# Altium schematic sheet 蓝桥杯2.0.SchDoc
size 508 x 317 mm; PageSetup: Record=PageOptions|CenterHorizontal=True|CenterVertical=True|PrintScale=0.56|XCorrection=1.00|YCorrection=1.00|PrintKind=0|BorderSize=5000000|LeftOffset=0|BottomOffset=0|Orientation=2|PaperLength=1000|PaperWidth=1000|Scale=100|PaperSource=7|PrintQuality=-4|MediaType=1|DitherType=10|PrintScaleMode=1|PaperKind=A4|PaperIndex=9
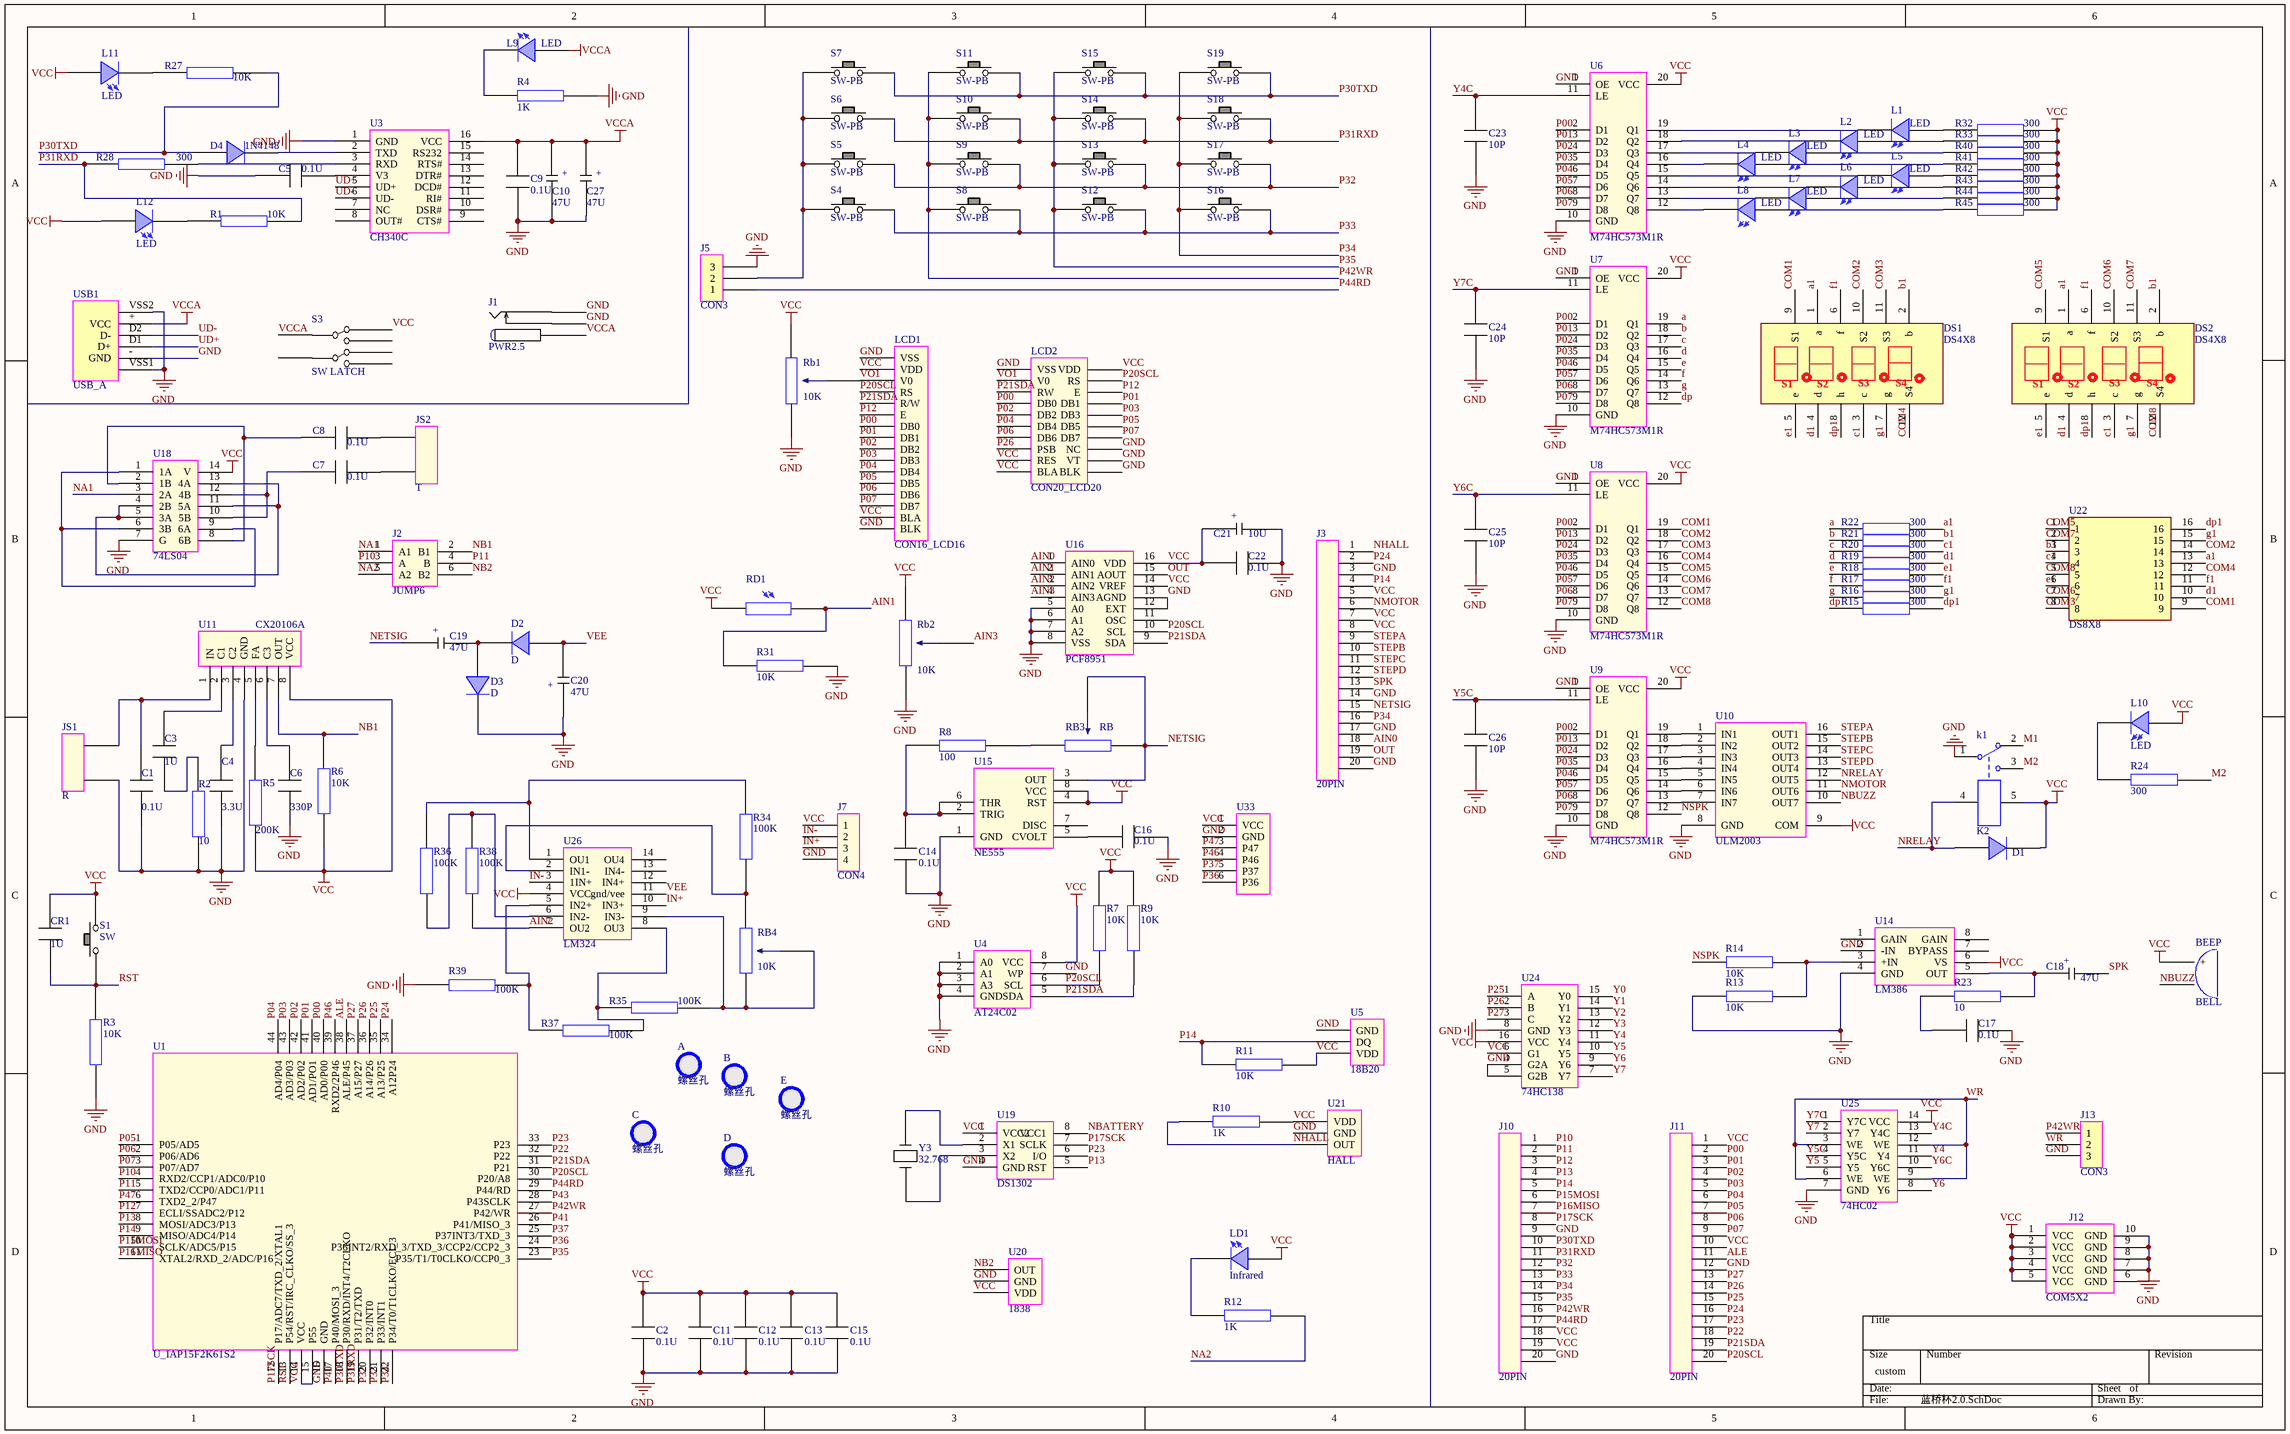
[diagram p0: 蓝桥杯2.0.SchDoc]

## Parts
A  螺丝孔  [LUOSIKONG]
B  螺丝孔  [LUOSIKONG]
BEEP  BELL  [BUZZER]
C  螺丝孔  [LUOSIKONG]
C1  0.1U  [C0805]
C2  0.1U  [C0805]
C3  1U  [C0805]
C4  3.3U  [C0805]
C5  0.1U  [C0805]
C6  330P  [C0805]
C7  0.1U  [C0805]
C8  0.1U  [C0805]
C9  0.1U  [C0805]
C10  47U  [RVT 16V]
C11  0.1U  [C0805]
C12  0.1U  [C0805]
C13  0.1U  [C0805]
C14  0.1U  [C0805]
C15  0.1U  [C0805]
C16  0.1U  [C0805]
C17  0.1U  [C0805]
C18  47U  [RVT 16V]
C19  47U  [RVT 16V]
C20  47U  [RVT 16V]
C21  10U  [RVT 16V]
C22  0.1U  [C0805]
C23  10P  [C0805]
C24  10P  [C0805]
C25  10P  [C0805]
C26  10P  [C0805]
C27  47U  [RVT 16V]
CR1  1U  [C0805]
D  螺丝孔  [LUOSIKONG]
D1  D  [D-DIODE-0805]  (value not drawn)
D2  D  [D-DIODE-0805]
D3  D  [D-DIODE-0805]
D4  1N4148  [D-DIODE-0805]
DS1  DS4X8  [DPY-4X8]
DS2  DS4X8  [DPY-4X8]
E  螺丝孔  [LUOSIKONG]
J1  PWR2.5  [PW 2.5]
J2  JUMP6  [SIP-3X2]
J3  20PIN  [SIP-20 - duplicate]
J5  CON3  [SIP-3]
J7  CON4  [SIP-4]
J10  20PIN  [SIP-20 - duplicate]
J11  20PIN  [SIP-20 - duplicate]
J12  COM5X2  [SIP-5X2]
J13  CON3  [SIP-3]
JS1  R  [RT-16]
JS2  T  [RT-16]
k1  K2  [HK-4100-F]
L1  LED  [L0805]
L2  LED  [L0805]
L3  LED  [L0805]
L4  LED  [L0805]
L5  LED  [L0805]
L6  LED  [L0805]
L7  LED  [L0805]
L8  LED  [L0805]
L9  LED  [L0805]
L10  LED  [L0805]
L11  LED  [L0805]
L12  LED  [L0805]
LCD1  CON16_LCD16  [SIP-16]
LCD2  CON20_LCD20  [SIP-20]
LD1  Infrared  [LED-LNF]
R1  10K  [R0805]
R2  10  [R0805]
R3  10K  [R0805]
R4  1K  [R0805]
R5  200K  [R0805]
R6  10K  [R0805]
R7  10K  [R0805]
R8  100  [R0805]
R9  10K  [R0805]
R10  1K  [R0805]
R11  10K  [R0805]
R12  1K  [R0805]
R13  10K  [R0805]
R14  10K  [R0805]
R15  300  [R0805]
R16  300  [R0805]
R17  300  [R0805]
R18  300  [R0805]
R19  300  [R0805]
R20  300  [R0805]
R21  300  [R0805]
R22  300  [R0805]
R23  10  [R0805]
R24  300  [R0805]
R27  10K  [R0805]
R28  300  [R0805]
R31  10K  [R0805]
R32  300  [R0805]
R33  300  [R0805]
R34  100K  [R0805]
R35  100K  [R0805]
R36  100K  [R0805]
R37  100K  [R0805]
R38  100K  [R0805]
R39  100K  [R0805]
R40  300  [R0805]
R41  300  [R0805]
R42  300  [R0805]
R43  300  [R0805]
R44  300  [R0805]
R45  300  [R0805]
Rb1  10K  [VR-3 10]
Rb2  10K  [VR-3 10]
RB3  RB  [VR-3 10]
RB4  10K  [VR-3 10]
RD1  RD  [AXIAL-0.2]  (value not drawn)
S1  SW  [SKOE]
S3  SW LATCH  [SW-PB]
S4  SW-PB  [SKOE]
S5  SW-PB  [SKOE]
S6  SW-PB  [SKOE]
S7  SW-PB  [SKOE]
S8  SW-PB  [SKOE]
S9  SW-PB  [SKOE]
S10  SW-PB  [SKOE]
S11  SW-PB  [SKOE]
S12  SW-PB  [SKOE]
S13  SW-PB  [SKOE]
S14  SW-PB  [SKOE]
S15  SW-PB  [SKOE]
S16  SW-PB  [SKOE]
S17  SW-PB  [SKOE]
S18  SW-PB  [SKOE]
S19  SW-PB  [SKOE]
U1  U_IAP15F2K61S2  [LQFP44 - duplicate]
U3  CH340C  [SOP-16]
U4  AT24C02  [SOP-8]
U5  18B20  [TO-92]
U6  M74HC573M1R  [TSOP-20(宽体)]
U7  M74HC573M1R  [TSOP-20(宽体)]
U8  M74HC573M1R  [TSOP-20(宽体)]
U9  M74HC573M1R  [TSOP-20(宽体)]
U10  ULM2003  [SOP-16]
U11  CX20106A  [DIP-8]
U14  LM386  [SOP-8]
U15  NE555  [SOP-8]
U16  PCF8951  [TSOP-16(宽体)]
U18  74LS04  [SOP-14]
U19  DS1302  [SOP-8]
U20  1838  [TO-92-A]
U21  HALL  [TO92-3]
U22  DS8X8  [DPY-8X8]
U24  74HC138  [SOP-16]
U25  74HC02  [SOP-14]
U26  LM324  [SOP-14]
U33  (no value)  [D0]
USB1  USB_A  [USB-B]
Y3  32.768  [XTAL1-37K]

## Nets
GND: C1.1 C2.1 C4.1 C5.1 C6.1 C9.1 C10.2(-) C11.1 C12.1 C13.1 C14.1 C15.1 C16.2 C17.2 C20.1(+) C21.2(-) C22.2 C23.1 C24.1 C25.1 C26.1 C27.2(-) D3.2 J1.GND J3.3 J3.14 J3.17 J3.20 J5.3 J7.4 J10.9 J10.20 J11.12 J12.6(GND) J12.7(GND) J12.8(GND) J12.9(GND) J12.10(GND) J13.3 JS1.2 k1.1 LCD1.1(VSS) LCD1.16(BLK) LCD2.1(VSS) LCD2.16(NC) LCD2.18(VT) LCD2.20(BLK) R2.1 R3.1 R4.1 R13.2 R31.1 R39.2 Rb1.1 Rb2.3 U1.16(GND) U3.1(GND) U4.1(A0) U4.2(A1) U4.3(A3) U4.4(GND) U4.7(WP) U5.1(GND) U6.1(OE) U6.10(GND) U7.1(OE) U7.10(GND) U8.1(OE) U8.10(GND) U9.1(OE) U9.10(GND) U10.8(GND) U11.4(GND) U14.2(-IN) U14.4(GND) U15.1(GND) U16.5(A0) U16.6(A1) U16.7(A2) U16.8(VSS) U16.12(EXT) U16.13(AGND) U18.7(G) U19.4(GND) U20.2(GND) U21.2(GND) U24.4(G2A) U24.5(G2B) U24.8(GND) U25.7(GND) U33.2(GND) USB1.-(GND) USB1.VSS1 USB1.VSS2
VCC: BEEP.1(+) C2.2 C11.2 C12.2 C13.2 C15.2 C21.1(+) C22.1 CR1.2 D1.2 J3.5 J3.7 J3.8 J7.1 J10.18 J10.19 J11.1 J11.10 J12.1(VCC) J12.2(VCC) J12.3(VCC) J12.4(VCC) J12.5(VCC) k1.5 L10.1 L11.1 L12.1 LCD1.2(VDD) LCD1.15(BLA) LCD2.2(VDD) LCD2.17(RES) LCD2.19(BLA) LD1.1 R5.1 R6.1 R7.2 R9.2 R10.1 R11.1 R32.1 R33.1 R40.1 R41.1 R42.1 R43.1 R44.1 R45.1 Rb1.3 Rb2.1 RD1.1 S1.1 S3.2 U1.14(VCC) U1.15(P55) U4.8(VCC) U5.3(VDD) U6.20(VCC) U7.20(VCC) U8.20(VCC) U9.20(VCC) U10.9(COM) U11.8(VCC) U14.6(VS) U15.4(RST) U15.8(VCC) U16.14(VREF) U16.16(VDD) U18.14(V) U19.1(VCC2) U20.3(VDD) U21.1(VDD) U24.6(G1) U24.16(VCC) U25.14(VCC) U26.4(VCC) U33.1(VCC)
VCCA: C9.2 C10.1(+) C27.1(+) J1.VCCA L9.1 S3.3 U3.16(VCC) USB1.+(VCC)
a: R22.2 U7.19(Q1)
a1: DS1.1(a) DS2.1(a) R22.1 U22.13
AIN0: J3.18 U16.1(AIN0)
AIN1: R31.2 RD1.2 U16.2(AIN1)
AIN2: R38.2 U16.3(AIN2) U26.7(OU2)
AIN3: Rb2.2 U16.4(AIN3)
ALE: J11.11 U1.38(ALE/P45)
b: R21.2 U7.18(Q2)
b1: DS1.2(b) DS2.2(b) R21.1 U22.3
c: R20.2 U7.17(Q3)
c1: DS1.3(c) DS2.3(c) R20.1 U22.4
COM1: DS1.9(S1) U8.19(Q1) U22.9
COM2: DS1.10(S2) U8.18(Q2) U22.14
COM3: DS1.11(S3) U8.17(Q3) U22.8
COM4: DS1.12(S4) U8.16(Q4) U22.12
COM5: DS2.9(S1) U8.15(Q5) U22.1
COM6: DS2.10(S2) U8.14(Q6) U22.7
COM7: DS2.11(S3) U8.13(Q7) U22.2
COM8: DS2.12(S4) U8.12(Q8) U22.5
d: R19.2 U7.16(Q4)
d1: DS1.4(d) DS2.4(d) R19.1 U22.10
dp: R15.2 U7.12(Q8)
dp1: DS1.8(h) DS2.8(h) R15.1 U22.16
e: R18.2 U7.15(Q5)
e1: DS1.5(e) DS2.5(e) R18.1 U22.6
f: R17.2 U7.14(Q6)
f1: DS1.6(f) DS2.6(f) R17.1 U22.11
g: R16.2 U7.13(Q7)
g1: DS1.7(g) DS2.7(g) R16.1 U22.15
IN+: J7.3 U26.10(IN3+)
IN-: J7.2 U26.3(1IN+)
M1: k1.2
M2: k1.3 R24.1
NA1: J2.1(A1) U18.3(2A)
NA2: J2.5(A2) R12.1
NB1: J2.2(B1) R6.2 U11.7(OUT)
NB2: J2.6(B2) U20.1(OUT)
NBATTERY: U19.8(VCC1)
NBUZZ: BEEP.2 U10.10(OUT7)
NETSIG: C19.1(+) J3.15 RB3.2 RB3.3 U15.3(OUT)
NHALL: J3.1 R10.2 U21.3(OUT)
NMOTOR: J3.6 U10.11(OUT6)
NRELAY: D1.1 k1.4 U10.12(OUT5)
NSPK: R14.2 U9.12(Q8)
OUT: J3.19 U16.15(AOUT)
P00: J11.2 LCD1.7(DB0) LCD2.7(DB0) U1.40(AD0/P00) U6.2(D1) U7.2(D1) U8.2(D1) U9.2(D1)
P01: J11.3 LCD1.8(DB1) LCD2.8(DB1) U1.41(AD1/PO1) U6.3(D2) U7.3(D2) U8.3(D2) U9.3(D2)
P02: J11.4 LCD1.9(DB2) LCD2.9(DB2) U1.42(AD2/P02) U6.4(D3) U7.4(D3) U8.4(D3) U9.4(D3)
P03: J11.5 LCD1.10(DB3) LCD2.10(DB3) U1.43(AD3/P03) U6.5(D4) U7.5(D4) U8.5(D4) U9.5(D4)
P04: J11.6 LCD1.11(DB4) LCD2.11(DB4) U1.44(AD4/P04) U6.6(D5) U7.6(D5) U8.6(D5) U9.6(D5)
P05: J11.7 LCD1.12(DB5) LCD2.12(DB5) U1.1(P05/AD5) U6.7(D6) U7.7(D6) U8.7(D6) U9.7(D6)
P06: J11.8 LCD1.13(DB6) LCD2.13(DB6) U1.2(P06/AD6) U6.8(D7) U7.8(D7) U8.8(D7) U9.8(D7)
P07: J11.9 LCD1.14(DB7) LCD2.14(DB7) U1.3(P07/AD7) U6.9(D8) U7.9(D8) U8.9(D8) U9.9(D8)
P10: J2.3(A) J10.1 U1.4(RXD2/CCP1/ADC0/P10)
P11: J2.4(B) J10.2 U1.5(TXD2/CCP0/ADC1/P11)
P12: J10.3 LCD1.6(E) LCD2.6(E) U1.7(ECLI/SSADC2/P12)
P13: J10.4 U1.8(MOSI/ADC3/P13) U19.5(RST)
P14: J3.4 J10.5 R11.2 U1.9(MISO/ADC4/P14) U5.2(DQ)
P15MOSI: J10.6 U1.10(SCLK/ADC5/P15)
P16MISO: J10.7 U1.11(XTAL2/RXD_2/ADC/P16)
P17SCK: J10.8 U1.12(P17/ADC7/TXD_2/XTAL1) U19.7(SCLK)
P20SCL: J11.20 LCD1.4(RS) LCD2.4(RS) R7.1 U1.30(P20/A8) U4.6(SCL) U16.10(SCL)
P21SDA: J11.19 LCD1.5(R/W) LCD2.5(RW) R9.1 U1.31(P21) U4.5(SDA) U16.9(SDA)
P22: J11.18 U1.32(P22)
P23: J11.17 U1.33(P23) U19.6(I/O)
P24: J3.2 J11.16 U1.34(A12P24)
P25: J11.15 U1.35(A13/P25) U24.1(A)
P26: J11.14 LCD2.15(PSB) U1.36(A14/P26) U24.2(B)
P27: J11.13 U1.37(A15/P27) U24.3(C)
P30TXD: D4.1 J10.10 R27.1 S7.1 S11.1 S15.1 S19.1 U1.18(P30/RXD/INT4/T2CLKO)
P31RXD: J10.11 R1.1 R28.2 S6.1 S10.1 S14.1 S18.1 U1.19(P31/T2/TXD)
P32: J10.12 S5.1 S9.1 S13.1 S17.1 U1.20(P32/INT0)
P33: J10.13 S4.1 S8.1 S12.1 S16.1 U1.21(P33/INT1)
P34: J3.16 J10.14 S16.2 S17.2 S18.2 S19.2 U1.22(P34/T0/T1CLKO/ECI_3)
P35: J10.15 S12.2 S13.2 S14.2 S15.2 U1.23(P35/T1/T0CLKO/CCP0_3)
P36: U1.24(P36INT2/RXD_3/TXD_3/CCP2/CCP2_3) U33.6(P36)
P37: U1.25(P37INT3/TXD_3) U33.5(P37)
P40: U1.17(P40/MOSI_3)
P41: U1.26(P41/MISO_3)
P42WR: J10.16 J13.1 S8.2 S9.2 S10.2 S11.2 U1.27(P42/WR)
P43: U1.28(P43SCLK)
P44RD: J5.1 J10.17 U1.29(P44/RD)
P46: U1.39(RXD2/2P46) U33.4(P46)
P47: U1.6(TXD2_2/P47) U33.3(P47)
RST: CR1.1 R3.2 S1.2 U1.13(P54/RST/IRC_CLKO/SS_3)
SPK: C18.2(-) J3.13
STEPA: J3.9 U10.16(OUT1)
STEPB: J3.10 U10.15(OUT2)
STEPC: J3.11 U10.14(OUT3)
STEPD: J3.12 U10.13(OUT4)
UD+: U3.5(UD+) USB1.D1(D+)
UD-: U3.6(UD-) USB1.D2(D-)
VEE: C20.2(-) D2.1 U26.11(gnd/vee)
VO1: LCD1.3(V0) LCD2.3(V0) Rb1.2
WR: J13.2 U25.3(WE) U25.6(WE) U25.9(WE) U25.12(WE)
Y0: U24.15(Y0)
Y1: U24.14(Y1)
Y2: U24.13(Y2)
Y3: U24.12(Y3)
Y4: U24.11(Y4) U25.11(Y4)
Y4C: C23.2 U6.11(LE) U25.13(Y4C)
Y5: U24.10(Y5) U25.5(Y5)
Y5C: C26.2 U9.11(LE) U25.4(Y5C)
Y6: U24.9(Y6) U25.8(Y6)
Y6C: C25.2 U8.11(LE) U25.10(Y6C)
Y7: U24.7(Y7) U25.2(Y7)
Y7C: C24.2 U7.11(LE) U25.1(Y7C)
NetC1_2: C1.2 JS1.1 U11.1(IN)
NetC3_1: C3.1 R2.2
NetC3_2: C3.2 U11.2(C1)
NetC4_2: C4.2 U11.3(C2)
NetC5_2: C5.2 U3.4(V3)
NetC6_2: C6.2 U11.6(C3)
NetC7_1: C7.1 U18.10(5B) U18.12(4B)
NetC7_2: C7.2 JS2.1
NetC8_1: C8.1 U18.2(1B) U18.8(6B)
NetC8_2: C8.2 JS2.2
NetC14_2: C14.2 R8.2 U15.2(TRIG) U15.6(THR)
NetC16_1: C16.1 U15.5(CVOLT)
NetC17_1: C17.1 R23.2
NetC18_1: C18.1(+) R23.1 U14.5(OUT)
NetC19_2: C19.2(-) D2.2 D3.1
NetD4_2: D4.2 U3.2(TXD)
NetJ5_2: J5.2 S4.2 S5.2 S6.2 S7.2
NetL1_1: L1.1 R32.2
NetL1_2: L1.2 U6.19(Q1)
NetL2_1: L2.1 R33.2
NetL2_2: L2.2 U6.18(Q2)
NetL3_1: L3.1 R40.2
NetL3_2: L3.2 U6.17(Q3)
NetL4_1: L4.1 R41.2
NetL4_2: L4.2 U6.16(Q4)
NetL5_1: L5.1 R42.2
NetL5_2: L5.2 U6.15(Q5)
NetL6_1: L6.1 R43.2
NetL6_2: L6.2 U6.14(Q6)
NetL7_1: L7.1 R44.2
NetL7_2: L7.2 U6.13(Q7)
NetL8_1: L8.1 R45.2
NetL8_2: L8.2 U6.12(Q8)
NetL9_2: L9.2 R4.2
NetL10_2: L10.2 R24.2
NetL11_2: L11.2 R27.2
NetL12_2: L12.2 R1.2
NetLD1_2: LD1.2 R12.2
NetR5_2: R5.2 U11.5(FA)
NetR8_1: R8.1 RB3.1
NetR13_1: R13.1 R14.1 U14.3(+IN)
NetR28_1: R28.1 U3.3(RXD)
NetR34_1: R34.1 R36.1 U26.1(OU1)
NetR34_2: R34.2 RB4.1 U26.2(IN1-)
NetR35_1: R35.1 RB4.2 RB4.3 U26.9(IN3-)
NetR35_2: R35.2 R37.1 U26.8(OU3)
NetR36_2: R36.2 R38.1 U26.6(IN2-)
NetR37_2: R37.2 R39.1 U26.5(IN2+)
NetU9_13: U9.13(Q7) U10.7(IN7)
NetU9_14: U9.14(Q6) U10.6(IN6)
NetU9_15: U9.15(Q5) U10.5(IN5)
NetU9_16: U9.16(Q4) U10.4(IN4)
NetU9_17: U9.17(Q3) U10.3(IN3)
NetU9_18: U9.18(Q2) U10.2(IN2)
NetU9_19: U9.19(Q1) U10.1(IN1)
NetU18_1: U18.1(1A) U18.6(3B) U18.9(6A)
NetU18_4: U18.4(2B) U18.5(3A) U18.11(5A) U18.13(4A)
NetU19_2: U19.2(X1) Y3.2
NetU19_3: U19.3(X2) Y3.1

Not connected (* = marked no-connect by the designer): S3 1 4 5 6; U3 7(NC) 8(OUT#) 9(CTS#) 10(DSR#) 11(RI#) 12(DCD#) 13(DTR#) 14(RTS#) 15(RS232); U14 1(GAIN) 7(BYPASS) 8(GAIN); U15 7(DISC); U16 11(OSC); U26 12(IN4+) 13(IN4-) 14(OU4)

## Library data of the parts
C1-C9 C11-C17 C22-C26 CR1 = C
C10 C18-C21 C27 = 贴片电解电容
D4 = D
J2 = OP6
J3 J10 J11 = P20
J5 J13 = COM3
J7 = COM4
JS1 JS2 = JS
LCD1 = LCD16
LCD2 = LCD20
LD1 = INF
R1-R24 R27 R28 R31-R45 = R
Rb1 Rb2 RB4 = RB
S1 S4-S19 = 贴片按键
S3 = KG
U1 = STC15
U6-U9 = CH573
U33 = 洞洞板
Y3 = Y3